# Altium project IDCI_TP1_SFARA.PrjPcb
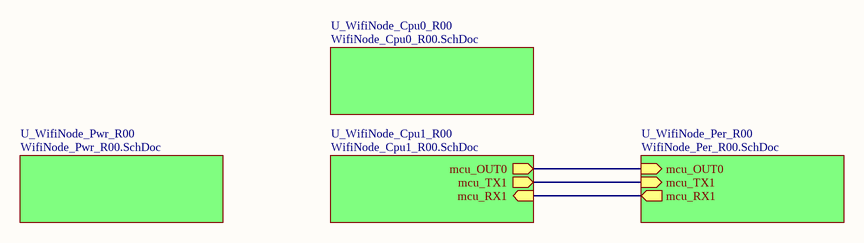
[diagram p0: WifiNode_Blk_R00.SchDoc]
5 sheets, 52 parts. Net scope: hierarchical (ports join the sheet entries above them; power ports are global).
Board files: WifiNode.PcbDoc, WifiNodePanel.PcbDoc
Sheets:
  WifiNode_Blk_R00.SchDoc
    U_WifiNode_Cpu0_R00 = WifiNode_Cpu0_R00.SchDoc
    U_WifiNode_Pwr_R00 = WifiNode_Pwr_R00.SchDoc
    U_WifiNode_Cpu1_R00 = WifiNode_Cpu1_R00.SchDoc
    U_WifiNode_Per_R00 = WifiNode_Per_R00.SchDoc

## Sheet WifiNode_Blk_R00.SchDoc: WifiNode_Blk_R00
size A4; Author: Sfara, Gonzalo Agustín; CompanyName: Introducción al Diseño de Circuitos Impresos; Organization: UTN FRBA; Revision: 00; SheetNumber: 1; SheetTotal: 5

### Sub-sheets
U_WifiNode_Cpu0_R00 = WifiNode_Cpu0_R00.SchDoc: no entries
U_WifiNode_Cpu1_R00 = WifiNode_Cpu1_R00.SchDoc: mcu_OUT0 (out), mcu_TX1 (out), mcu_RX1 (in)
U_WifiNode_Per_R00 = WifiNode_Per_R00.SchDoc: mcu_OUT0 (in), mcu_RX1 (out), mcu_TX1 (in)
U_WifiNode_Pwr_R00 = WifiNode_Pwr_R00.SchDoc: no entries

### Nets
mcu_OUT0: sheet U_WifiNode_Cpu1_R00/mcu_OUT0, sheet U_WifiNode_Per_R00/mcu_OUT0
NetU1_58: sheet U_WifiNode_Cpu1_R00/mcu_TX1, sheet U_WifiNode_Per_R00/mcu_TX1
NetU1_59: sheet U_WifiNode_Cpu1_R00/mcu_RX1, sheet U_WifiNode_Per_R00/mcu_RX1

### Notes on the sheet
- Title:
- Size:
- Author:
- A4
- Sheet
- of
- Revision:
- File:
- Date:

## Sheet WifiNode_Cpu0_R00.SchDoc: WifiNode_Cpu0_R00
size A4; Author: Sfara, Gonzalo Agustín; CompanyName: Introducción al Diseño de Circuitos Impresos; Organization: UTN FRBA; Revision: 00; SheetNumber: 3; SheetTotal: 5
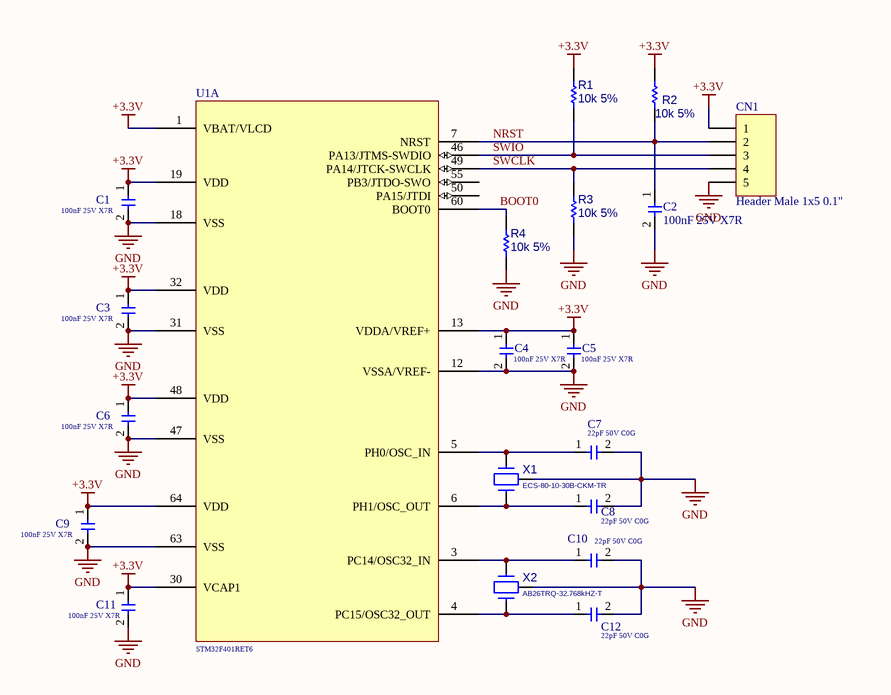
[diagram p1: WifiNode_Cpu0_R00.SchDoc]

### Parts
C1  100nF 25V X7R  [C_0805]
C2  100nF 25V X7R  [C_0805]
C3  100nF 25V X7R  [C_0805]
C4  100nF 25V X7R  [C_0805]
C5  100nF 25V X7R  [C_0805]
C6  100nF 25V X7R  [C_0805]
C7  22pF 50V C0G  [C_0805]
C8  22pF 50V C0G  [C_0805]
C9  100nF 25V X7R  [C_0805]
C10  22pF 50V C0G  [C_0805]
C11  100nF 25V X7R  [C_0805]
C12  22pF 50V C0G  [C_0805]
CN1  Header Male 1x5 0.1"  [Header_M_1x5_0.1"]
R1  10k 5%  [R_0805]
R2  10k 5%  [R_0805]
R3  10k 5%  [R_0805]
R4  10k 5%  [R_0805]
U1  STM32F401RET6  [LQFP_64]  (part A of 2)
X1  ECS-80-10-30B-CKM-TR  [ABM3C]
X2  AB26TRQ-32.768kHZ-T  [AB26TQF]

### Nets
+3.3V: C1.1 C3.1 C4.1 C5.1 C6.1 C9.1 C11.1 CN1.1 R1.2 R2.2 U1.1(VBAT/VLCD) U1.13(VDDA/VREF+) U1.19(VDD) U1.30(VCAP1) U1.32(VDD) U1.48(VDD) U1.64(VDD)
GND: C1.2 C2.2 C3.2 C4.2 C5.2 C6.2 C7.2 C8.2 C9.2 C10.2 C11.2 C12.2 CN1.5 R3.1 R4.1 U1.12(VSSA/VREF-) U1.18(VSS) U1.31(VSS) U1.47(VSS) U1.63(VSS) X1.3 X2.3
BOOT0: R4.2 U1.60(BOOT0)
NRST: C2.1 CN1.2 R2.1 U1.7(NRST)
SWCLK: CN1.4 R3.2 U1.49(PA14/JTCK-SWCLK)
SWIO: CN1.3 R1.1 U1.46(PA13/JTMS-SWDIO)
NetC7_1: C7.1 U1.5(PH0/OSC_IN) X1.2
NetC8_1: C8.1 U1.6(PH1/OSC_OUT) X1.1
NetC10_1: C10.1 U1.3(PC14/OSC32_IN) X2.2
NetC12_1: C12.1 U1.4(PC15/OSC32_OUT) X2.1

Not connected (* = marked no-connect by the designer): U1 50(PA15/JTDI) 55(PB3/JTDO-SWO)

### Notes on the sheet
- Title:
- Size:
- Author:
- A4
- Sheet
- of
- Revision:
- File:
- Date:

### Library data of the parts
C1-C12 = CAP_NP: Not polarized capacitor
CN1 = CONN_05P: Connector Generic 5 Vias
R1-R4 = Res1: Resistor
U1 = STM32F401RE
X1 X2 = CRYSTAL 3P: Crystal 2 Vias + GND

## Sheet WifiNode_Pwr_R00.SchDoc: WifiNode_Pwr_R00
size A4; Author: Sfara, Gonzalo Agustín; CompanyName: Introducción al Diseño de Circuitos Impresos; Organization: UTN FRBA; Revision: 00; SheetNumber: 2; SheetTotal: 6
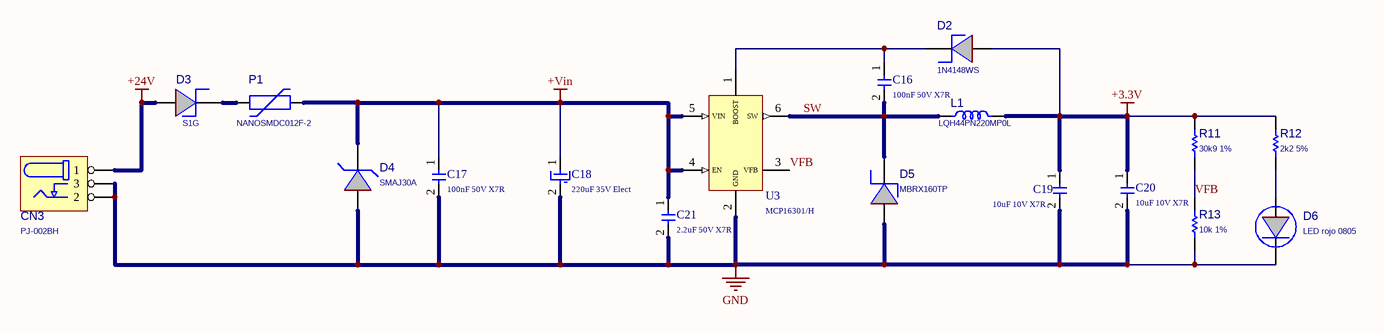
[diagram p2: WifiNode_Pwr_R00.SchDoc]

### Parts
C16  100nF 50V X7R  [C_0805]
C17  100nF 50V X7R  [C_0805]
C18  220uF 35V Elect  [C_RAD_0.135_H_8X12_S]
C19  10uF 10V X7R  [C_0805]
C20  10uF 10V X7R  [C_0805]
C21  2.2uF 50V X7R  [C_1206]
CN3  PJ-002BH  [PJ002B]
D2  1N4148WS  [D_0805]
D3  S1G  [D_SMA]
D4  SMAJ30A  [D_SMA]
D5  MBRX160TP  [SOD_123]
D6  LED rojo 0805  [D_0805]
L1  LQH44PN220MP0L  [LQH44]
P1  NANOSMDC012F-2  [NANOSMDC]
R11  30k9 1%  [R_0805]
R12  2k2 5%  [R_0805]
R13  10k 1%  [R_0805]
U3  MCP16301/H  [SOT23-6]

### Nets
+3.3V: C19.1 C20.1 D2.1(A) L1.2 R11.2 R12.2
+24V: CN3.1 D3.1(A)
+Vin: C17.1 C18.1 C21.1 D4.2(K) P1.2 U3.4(EN) U3.5(VIN)
GND: C17.2 C18.2 C19.2 C20.2 C21.2 CN3.2 CN3.3 D4.1(A) D5.1(A) D6.2(K) R13.1 U3.2(GND)
SW: C16.2 D5.2(K) L1.1 U3.6(SW)
VFB: R11.1 R13.2 U3.3(VFB)
NetC16_1: C16.1 D2.2(K) U3.1(BOOST)
NetD3_2: D3.2(K) P1.1
NetD6_1: D6.1(A) R12.1

### Notes on the sheet
- Title:
- Size:
- Author:
- A4
- Sheet
- of
- Revision:
- File:
- Date:

### Library data of the parts
C16 C17 C19-C21 = CAP_NP: Not polarized capacitor
C18 = CAP_P: Polarized capacitor
CN3 = CN_PowerJack: Barrel Power Connector
D2 D3 D5 = DIODO_SH: Diode Shottky
D4 = DIODE_TVS_1: Unidirectional TVS
D6 = LED_1: LED
L1 = IND: Inductor
P1 = PLYSW: Polyswitch
R11-R13 = Res1: Resistor

## Sheet WifiNode_Cpu1_R00.SchDoc: WifiNode_Cpu1_R00
size A4; Author: Sfara, Gonzalo Agustín; CompanyName: Introducción al Diseño de Circuitos Impresos; Organization: UTN FRBA; Revision: 00; SheetNumber: 4; SheetTotal: 6
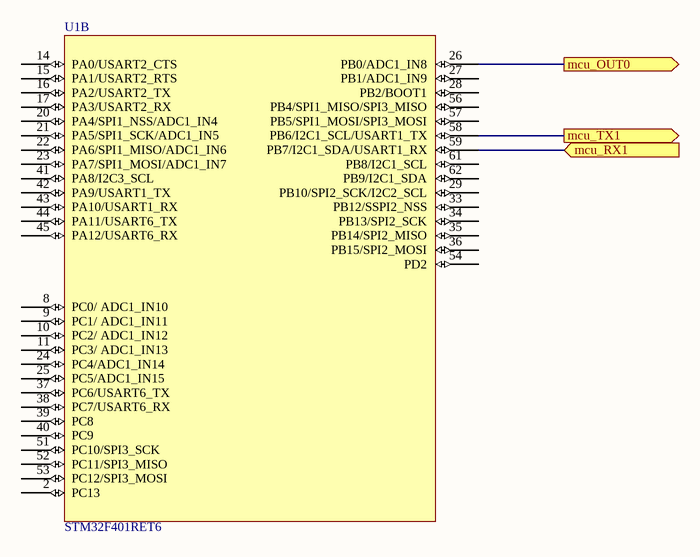
[diagram p3: WifiNode_Cpu1_R00.SchDoc]

### Parts
U1  STM32F401RET6  [LQFP_64]  (part B of 2)

### Ports
mcu_OUT0 (out), mcu_RX1 (in), mcu_TX1 (out)

### Nets
mcu_OUT0: U1.26(PB0/ADC1_IN8) ; port mcu_OUT0
NetU1_58: U1.58(PB6/I2C1_SCL/USART1_TX) ; port mcu_TX1
NetU1_59: U1.59(PB7/I2C1_SDA/USART1_RX) ; port mcu_RX1

Not connected (* = marked no-connect by the designer): U1 2(PC13) 8(PC0/_ADC1_IN10) 9(PC1/_ADC1_IN11) 10(PC2/_ADC1_IN12) 11(PC3/_ADC1_IN13) 14(PA0/USART2_CTS) 15(PA1/USART2_RTS) 16(PA2/USART2_TX) 17(PA3/USART2_RX) 20(PA4/SPI1_NSS/ADC1_IN4) 21(PA5/SPI1_SCK/ADC1_IN5) 22(PA6/SPI1_MISO/ADC1_IN6) 23(PA7/SPI1_MOSI/ADC1_IN7) 24(PC4/ADC1_IN14) 25(PC5/ADC1_IN15) 27(PB1/ADC1_IN9) 28(PB2/BOOT1) 29(PB10/SPI2_SCK/I2C2_SCL) 33(PB12/SSPI2_NSS) 34(PB13/SPI2_SCK) 35(PB14/SPI2_MISO) 36(PB15/SPI2_MOSI) 37(PC6/USART6_TX) 38(PC7/USART6_RX) 39(PC8) 40(PC9) 41(PA8/I2C3_SCL) 42(PA9/USART1_TX) 43(PA10/USART1_RX) 44(PA11/USART6_TX) 45(PA12/USART6_RX) 51(PC10/SPI3_SCK) 52(PC11/SPI3_MISO) 53(PC12/SPI3_MOSI) 54(PD2) 56(PB4/SPI1_MISO/SPI3_MISO) 57(PB5/SPI1_MOSI/SPI3_MOSI) 61(PB8/I2C1_SCL) 62(PB9/I2C1_SDA)

### Notes on the sheet
- Title:
- Size:
- Author:
- A4
- Sheet
- of
- Revision:
- File:
- Date:

### Library data of the parts
U1 = STM32F401RE

## Sheet WifiNode_Per_R00.SchDoc: WifiNode_Per_R00
size A4; Author: Sfara, Gonzalo Agustín; CompanyName: Introducción al Diseño de Circuitos Impresos; Organization: UTN FRBA; Revision: 00; SheetNumber: 5; SheetTotal: 6
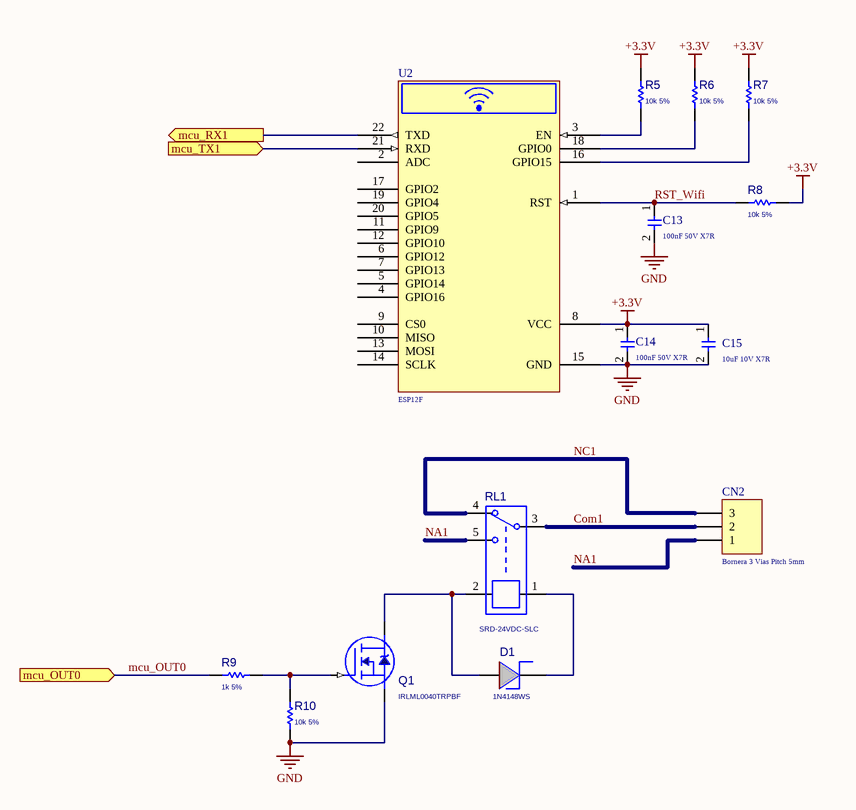
[diagram p4: WifiNode_Per_R00.SchDoc]

### Parts
C13  100nF 50V X7R  [C_0805]
C14  100nF 50V X7R  [C_0805]
C15  10uF 10V X7R  [C_0805]
CN2  Bornera 3 Vias Pitch 5mm  [TerminalBlock_1x3_P5mm]
D1  1N4148WS  [D_0805]
Q1  IRLML0040TRPBF  [SOT_23]
R5  10k 5%  [R_0805]
R6  10k 5%  [R_0805]
R7  10k 5%  [R_0805]
R8  10k 5%  [R_0805]
R9  1k 5%  [C_0805]
R10  10k 5%  [C_0805]
RL1  SRD-24VDC-SLC  [943-1C]
U2  ESP12F  [ESP12F]

### Ports
mcu_OUT0 (in), mcu_RX1 (out), mcu_TX1 (in)

### Nets
+3.3V: C14.1 C15.1 R5.2 R6.2 R7.2 R8.1 U2.8(VCC)
GND: C13.2 C14.2 C15.2 Q1.2(SOURCE) R10.1 U2.15(GND)
Com1: CN2.2 RL1.3
mcu_OUT0: R9.2 ; port mcu_OUT0
NA1: CN2.1 RL1.5
NC1: CN2.3 RL1.4
RST_Wifi: C13.1 R8.2 U2.1(RST)
NetD1_1: D1.1(A) Q1.3(DRAIN) RL1.2
NetD1_2: D1.2(K) RL1.1
NetQ1_1: Q1.1(GATE) R9.1 R10.2
NetR5_1: R5.1 U2.3(EN)
NetR6_1: R6.1 U2.18(GPIO0)
NetR7_1: R7.1 U2.16(GPIO15)
NetU1_58: U2.21(RXD) ; port mcu_TX1
NetU1_59: U2.22(TXD) ; port mcu_RX1

Not connected (* = marked no-connect by the designer): U2 2(ADC) 4(GPIO16) 5(GPIO14) 6(GPIO12) 7(GPIO13) 9(CS0) 10(MISO) 11(GPIO9) 12(GPIO10) 13(MOSI) 14(SCLK) 17(GPIO2) 19(GPIO4) 20(GPIO5)

### Notes on the sheet
- Title:
- Size:
- Author:
- A4
- Sheet
- of
- Revision:
- File:
- Date:

### Library data of the parts
C13-C15 = CAP_NP: Not polarized capacitor
CN2 = CONN_03P: Connector Generic 3 Vias
D1 = DIODO_SH: Diode Shottky
Q1 = N_MOSFET_SOT23: Mosfet N-Ch
R5-R10 = Res1: Resistor
RL1 = RELAY SPDT
U2 = ESP12F Wifi Module: Wifi Module

## Nets that join several sheets
+3.3V: WifiNode_Cpu0_R00 (17 pins), WifiNode_Pwr_R00 (6 pins), WifiNode_Per_R00 (7 pins)
GND: WifiNode_Cpu0_R00 (22 pins), WifiNode_Pwr_R00 (12 pins), WifiNode_Per_R00 (6 pins)
mcu_OUT0: WifiNode_Cpu1_R00 (U1.26), WifiNode_Per_R00 (R9.2)
NetU1_58: WifiNode_Cpu1_R00 (U1.58), WifiNode_Per_R00 (U2.21)
NetU1_59: WifiNode_Cpu1_R00 (U1.59), WifiNode_Per_R00 (U2.22)